# EAGLE design PAOPCB (EAGLE 7.3.0)
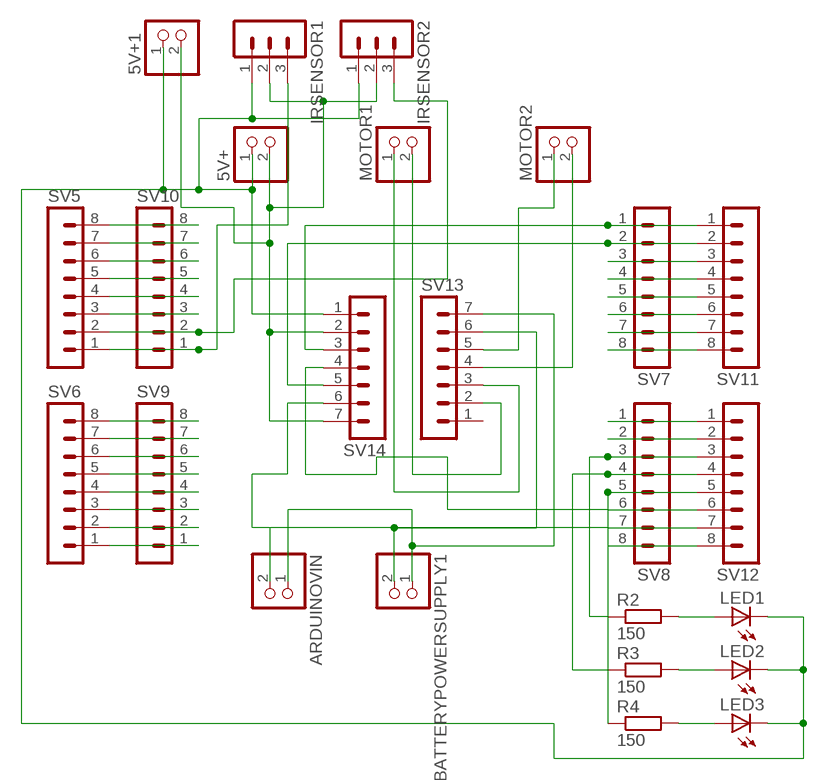
[diagram p0: schematic, sheet 1]

## Parts
5V+  PINHD-1X2  [1X02]
5V+1  PINHD-1X2  [1X02]
ARDUINOVIN  PINHD-1X2  [1X02]
BATTERYPOWERSUPPLY1  PINHD-1X2  [1X02]
IRSENSOR1  MA03-1  [MA03-1]
IRSENSOR2  MA03-1  [MA03-1]
LED1  LEDSML0805  [SML0805]
LED2  LEDSML0805  [SML0805]
LED3  LEDSML0805  [SML0805]
MOTOR1  PINHD-1X2  [1X02]
MOTOR2  PINHD-1X2  [1X02]
R2  150  R-EU_M0805  [M0805]
R3  150  R-EU_M0805  [M0805]
R4  150  R-EU_M0805  [M0805]
SV5  MA08-1  [MA08-1]
SV6  MA08-1  [MA08-1]
SV7  MA08-1  [MA08-1]
SV8  MA08-1  [MA08-1]
SV9  MA08-1  [MA08-1]
SV10  MA08-1  [MA08-1]
SV11  MA08-1  [MA08-1]
SV12  MA08-1  [MA08-1]
SV13  MA07-1  [MA07-1]
SV14  MA07-1  [MA07-1]

## Nets
N$1: 5V+1.1 5V+.1 IRSENSOR1.1 IRSENSOR2.1 LED1.C LED2.C LED3.C SV14.1
N$2: LED1.A R2.2
N$3: LED2.A R3.2
N$4: LED3.A R4.2
N$5: ARDUINOVIN.1 BATTERYPOWERSUPPLY1.1 SV13.7
N$6: SV8.1 SV12.1
N$10: SV8.6 SV12.6 SV14.4
N$11: SV5.8 SV10.8
N$12: SV5.7 SV10.7
N$13: SV5.6 SV10.6
N$14: SV5.5 SV10.5
N$15: SV5.4 SV10.4
N$16: SV5.3 SV10.3
N$17: IRSENSOR2.3 SV5.2 SV10.2
N$18: IRSENSOR1.3 SV5.1 SV10.1
N$19: SV6.8 SV9.8
N$20: SV6.7 SV9.7
N$21: SV6.6 SV9.6
N$22: SV6.5 SV9.5
N$23: SV6.4 SV9.4
N$24: SV6.3 SV9.3
N$25: SV6.2 SV9.2
N$26: SV6.1 SV9.1
N$27: SV7.1 SV11.1 SV14.3
N$28: SV7.2 SV11.2 SV14.5
N$29: SV7.3 SV11.3
N$30: SV7.4 SV11.4
N$31: SV7.5 SV11.5
N$32: SV7.6 SV11.6
N$33: SV7.7 SV11.7
N$34: SV7.8 SV11.8
N$35: SV8.7 SV12.7 SV14.6
N$36: SV8.2 SV12.2
N$37: R2.1 SV8.3 SV12.3
N$38: R3.1 SV8.4 SV12.4
N$39: R4.1 SV8.5 SV12.5
N$42: SV8.8 SV12.8
N$44: ARDUINOVIN.2 BATTERYPOWERSUPPLY1.2 SV13.6
N$45: MOTOR2.1 SV13.5
N$46: MOTOR2.2 SV13.4
N$47: MOTOR1.1 SV13.3
N$48: MOTOR1.2 SV13.2
N$49: 5V+1.2 5V+.2 IRSENSOR1.2 IRSENSOR2.2 SV14.2 SV14.7
Unconnected: SV13.1

## Library data of the parts
5V+ 5V+1 ARDUINOVIN BATTERYPOWERSUPPLY1 MOTOR1 MOTOR2 = pinhead:PINHD-1X2: PIN HEADER
IRSENSOR1 IRSENSOR2 = con-lstb:MA03-1: PIN HEADER; OC_FARNELL: unknown; OC_NEWARK: unknown
LED1-LED3 = led:LED: LED OSRAM: - CHIPLED LG R971, LG N971, LY N971, LG Q971, LY Q971, LO R971, LY R971 LH N974, LH R974 LS Q976, LO Q976, LY Q976 LO Q996 - Hyper CHIPLED LW Q18S LB Q993, LB Q99A, LB R99A - SideLED LS A670, LO A670, LY A670, LG A670, LP A670 LB A673, LV A673, LT A673, LW A673 LH A674 LY A675 LS A676, LA A676, LO A676, LY A676, LW A676 LS A679, LY A679, LG A679 - Hyper Micro SIDELED® LS Y876, LA Y876, LO Y876, LY Y876 LT Y87S - SmartLED LW L88C, LW L88S LB L89C, LB L89S, LG L890 LS L89K, LO L89K, LY L89K LS L896, LA L896, LO L896, LY L896 - TOPLED LS T670, LO T670, LY T670, LG T670, LP T670 LSG T670, LSP T670, LSY T670, LOP T670, LYG T670 LG T671, LOG T671, LSG T671 LB T673, LV T673, LT T673, LW T673 LH T674 LS T676, LA T676, LO T676, LY T676, LB T676, LH T676, LSB T676, LW T676 LB T67C, LV T67C, LT T67C, LS T67K, LO T67K, LY T67K, LW E67C LS E67B, LA E67B, LO E67B, LY E67B, LB E67C, LV E67C, LT E67C LW T67C LS T679, LY T679, LG T679 LS T770, LO T770, LY T770, LG T770, LP T770 LB T773, LV T773, LT T773, LW T773 LH T774 LS E675, LA E675, LY E675, LS T675 LS T776, LA T776, LO T776, LY T776, LB T776 LHGB T686 LT T68C, LB T68C - Hyper Mini TOPLED® LB M676 - Mini TOPLED Santana® LG M470 LS M47K, LO M47K, LY M47K Source: http://www.osram.convergy.de LUXEON: - LUMILED® LXK2-PW12-R00, LXK2-PW12-S00, LXK2-PW14-U00, LXK2-PW14-V00 LXK2-PM12-R00, LXK2-PM12-S00, LXK2-PM14-U00 LXK2-PE12-Q00, LXK2-PE12-R00, LXK2-PE12-S00, LXK2-PE14-T00, LXK2-PE14-U00 LXK2-PB12-K00, LXK2-PB12-L00, LXK2-PB12-M00, LXK2-PB14-N00, LXK2-PB14-P00, LXK2-PB14-Q00 LXK2-PR12-L00, LXK2-PR12-M00, LXK2-PR14-Q00, LXK2-PR14-R00 LXK2-PD12-Q00, LXK2-PD12-R00, LXK2-PD12-S00 LXK2-PH12-R00, LXK2-PH12-S00 LXK2-PL12-P00, LXK2-PL12-Q00, LXK2-PL12-R00 Source: www.luxeon.com KINGBRIGHT: KA-3528ASYC Source: www.kingbright.com
R2-R4 = resistor:R-EU_: RESISTOR, European symbol
SV5-SV12 = con-lstb:MA08-1: PIN HEADER; OC_FARNELL: unknown; OC_NEWARK: unknown
SV13 SV14 = con-lstb:MA07-1: PIN HEADER; OC_FARNELL: unknown; OC_NEWARK: unknown

## Board
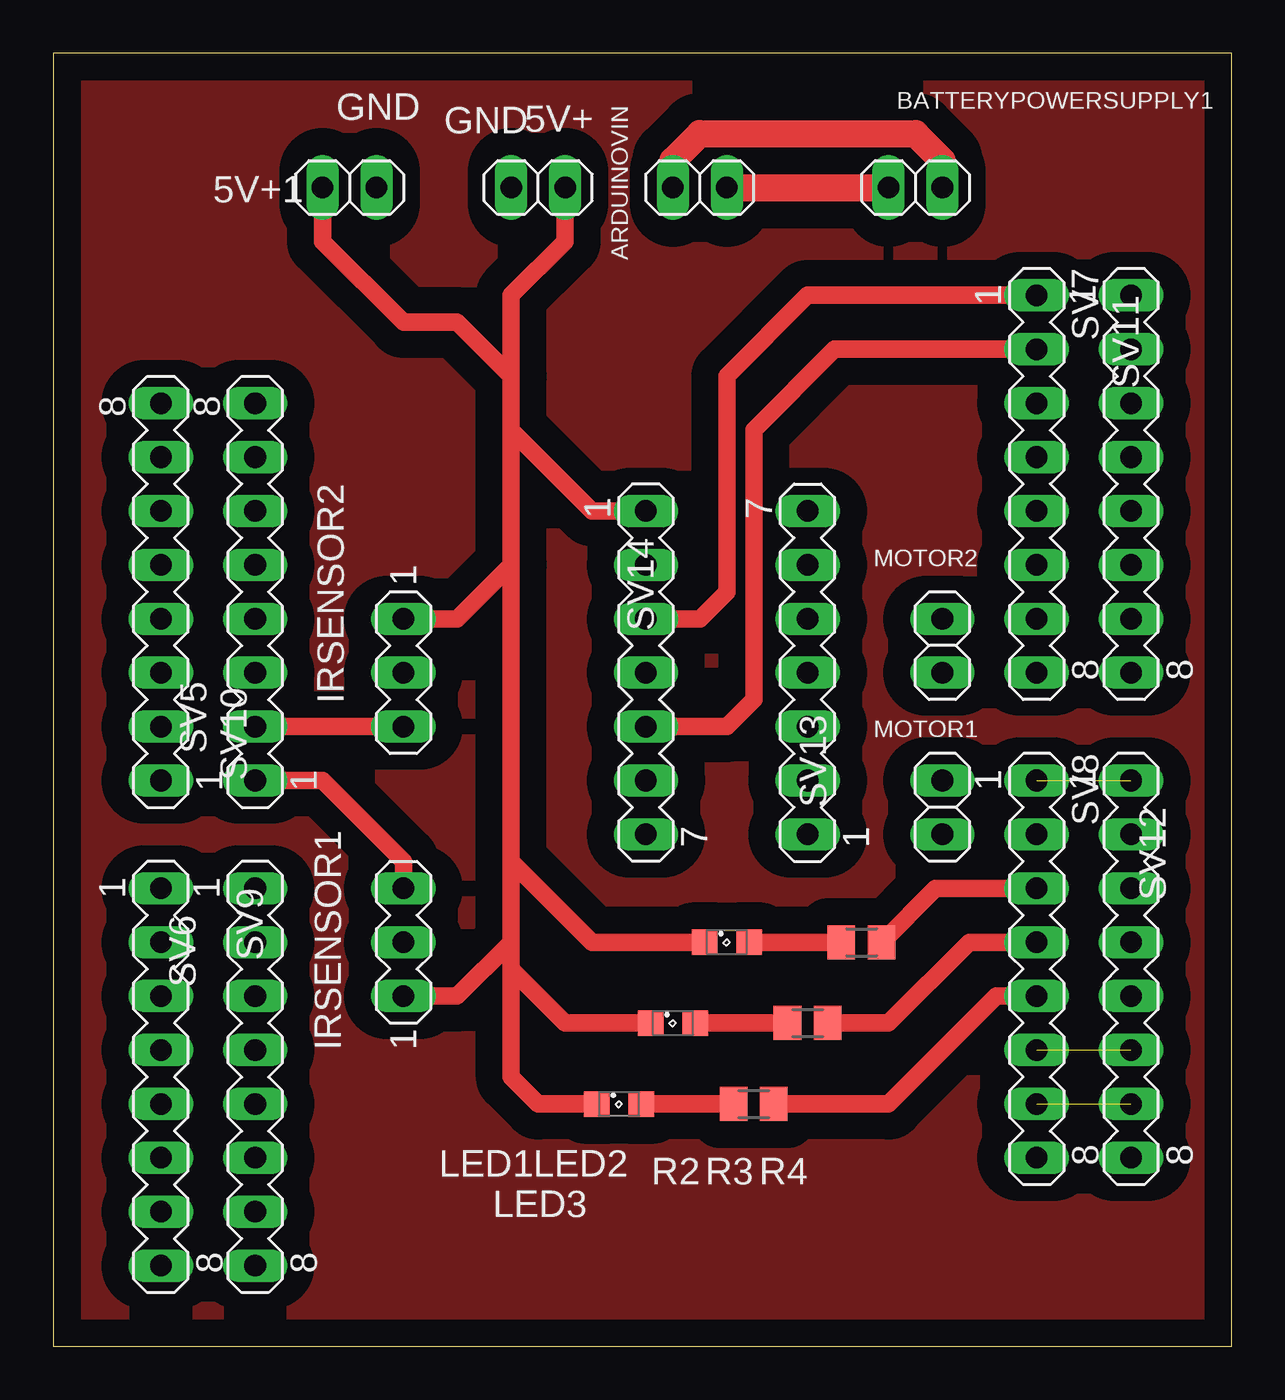
[diagram p1: board, top side]
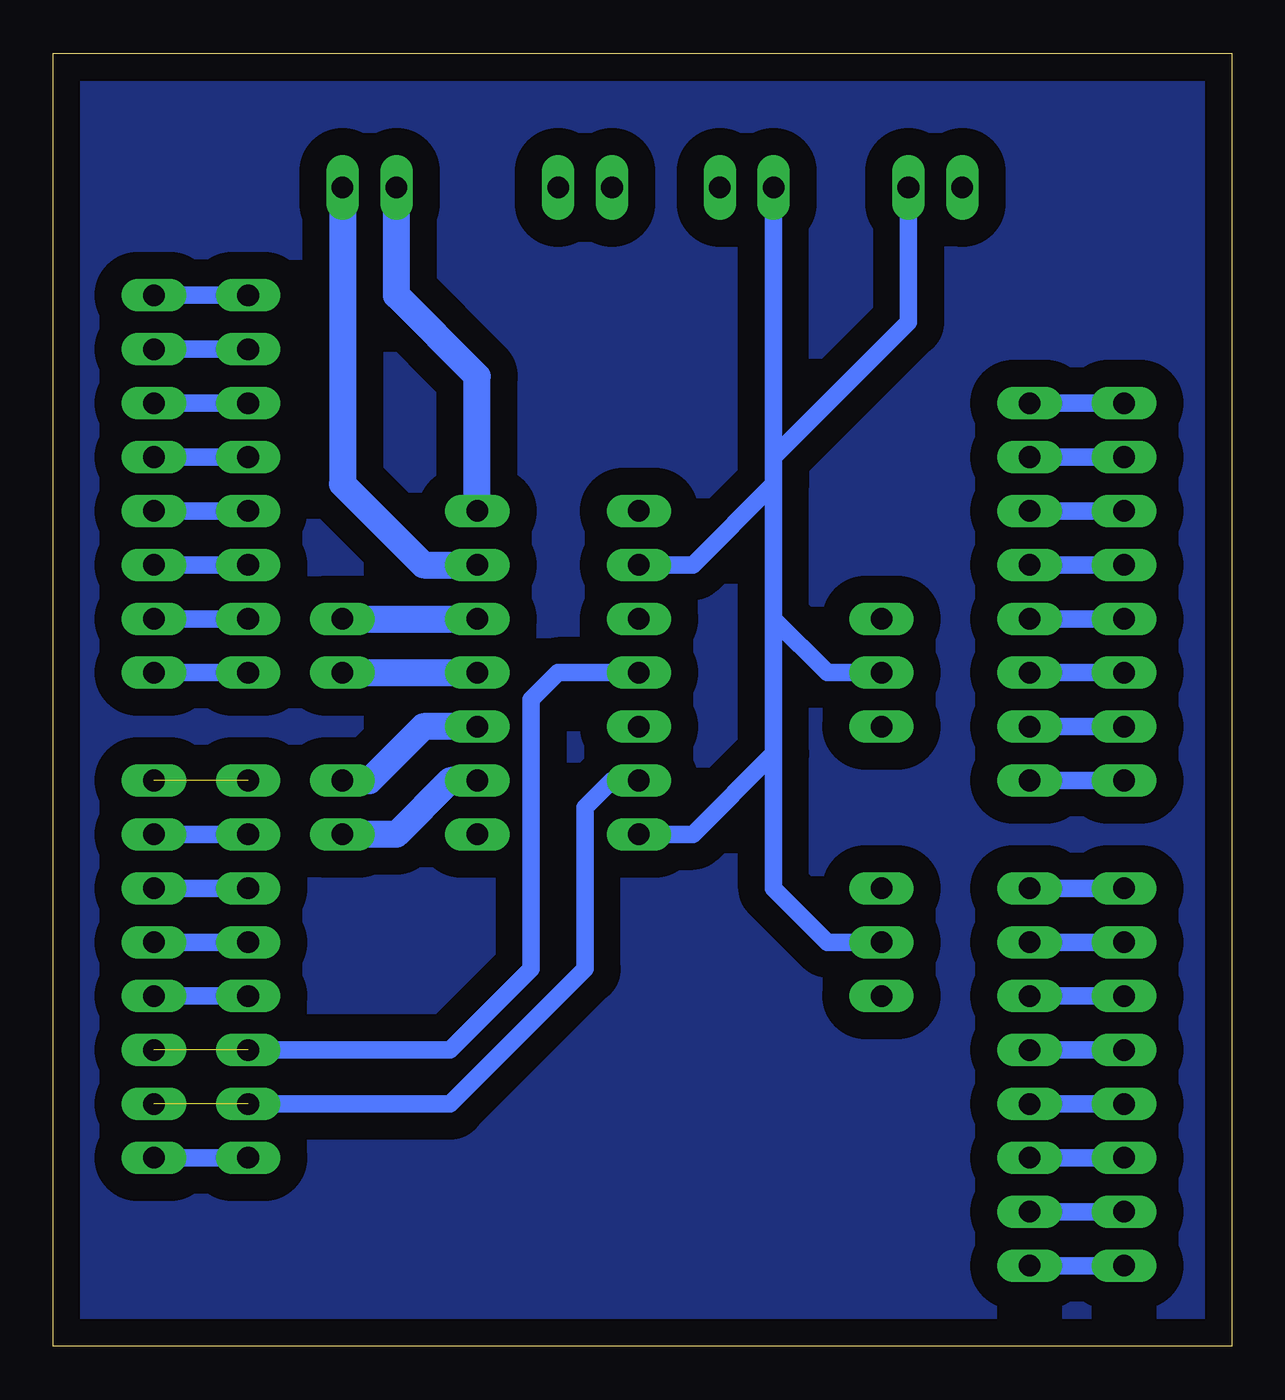
[diagram p2: board, bottom side, seen from below]

Size 55.55 x 60.95 mm. Coordinates in mm from the lower left corner, seen from the top.
Outline: 0,0 55.55,0 55.55,60.95 0,60.95 0,0
Copper layers (1*16): Top 0.035mm / dielectric 1.5mm / Bottom 0.035mm
Design rules "default": minimum track width 10mil, minimum drill 24mil, track to track 8mil, track to pad 8mil, pad to pad 8mil, via to via 8mil, smd to smd 8mil, copper to edge 40mil, drill to drill 8mil, minimum pad ring 10mil, minimum via ring 8mil, stop-mask expansion 4mil, vias tented up to drill 0mil, thermal gap 10mil

### Footprints (pad centres in the part's own frame; a part is rotated, then mirrored left to right if it is on the bottom)
1X02 = drill 1.016 long: 1 -1.27,0; 2 1.27,0
MA03-1 = drill 1.016 long: 1 -2.54,0; 2 0,0; 3 2.54,0
SML0805 = smd 1.2 x 1.2: A 1.05,0; C -1.05,0
M0805 = smd 1.3 x 1.6: 1 -0.95,0; 2 0.95,0
MA08-1 = drill 1.016 long: 1 -8.89,0; 2 -6.35,0; 3 -3.81,0; 4 -1.27,0; 5 1.27,0; 6 3.81,0; 7 6.35,0; 8 8.89,0
MA07-1 = drill 1.016 long: 1 -7.62,0; 2 -5.08,0; 3 -2.54,0; 4 0,0; 5 2.54,0; 6 5.08,0; 7 7.62,0

### Placement (x,y rotation side)
5V+  22.86,54.61 180 top
5V+1  13.97,54.61 0 top
ARDUINOVIN  30.48,54.61 180 top
BATTERYPOWERSUPPLY1  40.64,54.61 0 top
IRSENSOR1  16.51,19.05 90 top
IRSENSOR2  16.51,31.75 270 top
LED1  31.75,19.05 0 top
LED2  29.21,15.24 0 top
LED3  26.67,11.43 0 top
MOTOR1  41.91,25.4 270 top
MOTOR2  41.91,33.02 270 top
R2  38.1,19.05 180 top
R3  35.56,15.24 180 top
R4  33.02,11.43 180 top
SV5  5.08,35.56 90 top
SV6  5.08,12.7 270 top
SV7  46.35,40.64 270 top
SV8  46.35,17.78 270 top
SV9  9.53,12.7 270 top
SV10  9.53,35.56 90 top
SV11  50.8,40.64 270 top
SV12  50.8,17.78 270 top
SV13  35.56,31.75 90 top
SV14  27.94,31.75 270 top

### Tracks (layer width: path | path; a pad name or v marks a point on that pad's centre or on a via)
N$1
  Top 0.813: LED1.C 25.4,19.05 21.59,22.86 | 21.59,22.86 21.59,36.83 | 21.59,36.83 21.59,43.18 | 21.59,43.18 21.59,45.72 | 21.59,45.72 21.59,49.53 24.13,52.07 5V+.1 | LED2.C 24.13,15.24 21.59,17.78 | 21.59,17.78 21.59,19.05 | 21.59,19.05 21.59,22.86 | LED3.C 22.86,11.43 21.59,12.7 21.59,17.78 | IRSENSOR1.1 19.05,16.51 21.59,19.05 | IRSENSOR2.1 19.05,34.29 21.59,36.83 | 5V+1.1 12.7,52.07 16.51,48.26 19.05,48.26 21.59,45.72 | SV14.1 25.4,39.37 21.59,43.18
N$2
  Top 0.813: R2.2 LED1.A
N$3
  Top 0.813: R3.2 LED2.A
N$4
  Top 0.813: R4.2 LED3.A
N$5
  Top 1.27: ARDUINOVIN.1 BATTERYPOWERSUPPLY1.1
  Bottom 1.27: SV13.7 35.56,45.72 39.37,49.53 BATTERYPOWERSUPPLY1.1
N$6  (1 unrouted)
N$7
  pour Bottom (isolate 1.27): 54.61,1.27 54.61,59.69 1.27,59.69 1.27,1.27
N$9
  pour Top (isolate 1.27): 1.27,59.69 54.61,59.69 54.61,1.27 1.27,1.27
N$10  (1 unrouted)
  Bottom 0.813: SV14.4 31.75,31.75 33.02,30.48 33.02,17.78 36.83,13.97 SV8.6
N$11
  Bottom 0.813: SV5.8 SV10.8
N$12
  Bottom 0.813: SV5.7 SV10.7
N$13
  Bottom 0.813: SV5.6 SV10.6
N$14
  Bottom 0.813: SV5.5 SV10.5
N$15
  Bottom 0.813: SV10.4 SV5.4
N$16
  Bottom 0.813: SV10.3 SV5.3
N$17
  Top 0.813: SV10.2 IRSENSOR2.3
  Bottom 0.813: SV5.2 SV10.2
N$18
  Top 0.813: SV10.1 12.7,26.67 16.51,22.86 IRSENSOR1.3
  Bottom 0.813: SV5.1 SV10.1
N$19
  Bottom 0.813: SV6.8 SV9.8
N$20
  Bottom 0.813: SV6.7 SV9.7
N$21
  Bottom 0.813: SV6.6 SV9.6
N$22
  Bottom 0.813: SV9.5 SV6.5
N$23
  Bottom 0.813: SV6.4 SV9.4
N$24
  Bottom 0.813: SV9.3 SV6.3
N$25
  Bottom 0.813: SV6.2 SV9.2
N$26
  Bottom 0.813: SV6.1 SV9.1
N$27
  Top 0.813: SV14.3 30.48,34.29 31.75,35.56 31.75,45.72 35.56,49.53 SV7.1
  Bottom 0.813: SV11.1 SV7.1 45.72,49.53
N$28
  Top 0.813: SV14.5 31.75,29.21 33.02,30.48 33.02,43.18 36.83,46.99 SV7.2
  Bottom 0.813: SV11.2 SV7.2
N$29
  Bottom 0.813: SV11.3 SV7.3
N$30
  Bottom 0.813: SV11.4 SV7.4
N$31
  Bottom 0.813: SV11.5 SV7.5
N$32
  Bottom 0.813: SV11.6 SV7.6
N$33
  Bottom 0.813: SV11.7 SV7.7
N$34
  Bottom 0.813: SV11.8 SV7.8 45.72,31.75
N$35  (1 unrouted)
  Bottom 0.813: SV8.7 36.83,11.43 30.48,17.78 30.48,25.4 29.21,26.67 SV14.6
N$36
  Bottom 0.813: SV12.2 SV8.2
N$37
  Top 0.813: SV8.3 41.59,21.59 R2.1
  Bottom 0.813: SV12.3 SV8.3
N$38
  Top 0.813: SV8.4 43.18,19.05 39.37,15.24 R3.1
  Bottom 0.813: SV12.4 SV8.4
N$39
  Top 0.813: SV8.5 44.45,16.51 39.37,11.43 R4.1
  Bottom 0.813: SV12.5 SV8.5
N$42
  Bottom 0.813: SV12.8 SV8.8
N$44
  Top 1.27: ARDUINOVIN.2 29.21,55.88 30.48,57.15 40.64,57.15 41.91,55.88 BATTERYPOWERSUPPLY1.2
  Bottom 1.27: BATTERYPOWERSUPPLY1.2 41.91,40.64 38.1,36.83 SV13.6
N$45
  Bottom 1.27: MOTOR2.1 SV13.5
N$46
  Bottom 1.27: MOTOR2.2 SV13.4
N$47
  Bottom 1.27: SV13.3 38.1,29.21 40.64,26.67 MOTOR1.1
N$48
  Bottom 1.27: SV13.2 36.83,26.67 39.37,24.13 MOTOR1.2
N$49
  Bottom 0.813: IRSENSOR1.2 19.05,19.05 21.59,21.59 21.59,27.94 | 21.59,27.94 21.59,34.29 | 21.59,34.29 21.59,40.64 | 21.59,40.64 21.59,41.91 | 21.59,41.91 5V+.2 | 5V+1.2 15.24,48.26 21.59,41.91 | SV14.2 25.4,36.83 21.59,40.64 | IRSENSOR2.2 19.05,31.75 21.59,34.29 | SV14.7 25.4,24.13 21.59,27.94

### Text on the board
tNames: GND | GND